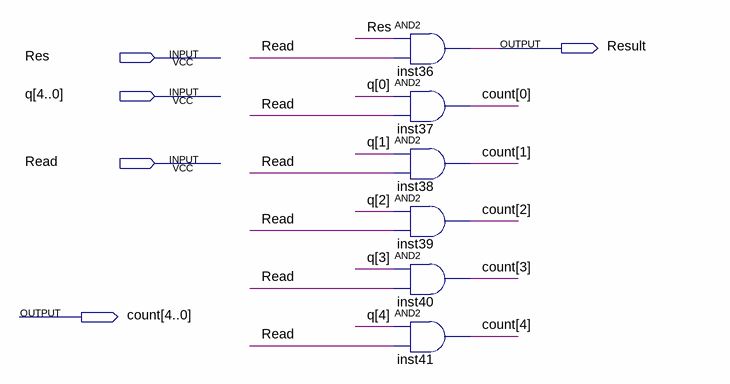
[diagram p0: schematic sheet]
// Quartus schematic output_handler.bdf as structural Verilog: 6 symbols, 5 pins
module output_handler (
  input  Res,
  input  [4:0] q,
  input  Read,
  output Result,
  output [4:0] count
);

  and inst36 (Result, Res, Read);
  and inst37 (count[0], q[0], Read);
  and inst38 (count[1], q[1], Read);
  and inst39 (count[2], q[2], Read);
  and inst40 (count[3], q[3], Read);
  and inst41 (count[4], q[4], Read);
endmodule
